# EAGLE design Moteino (EAGLE 6.3)
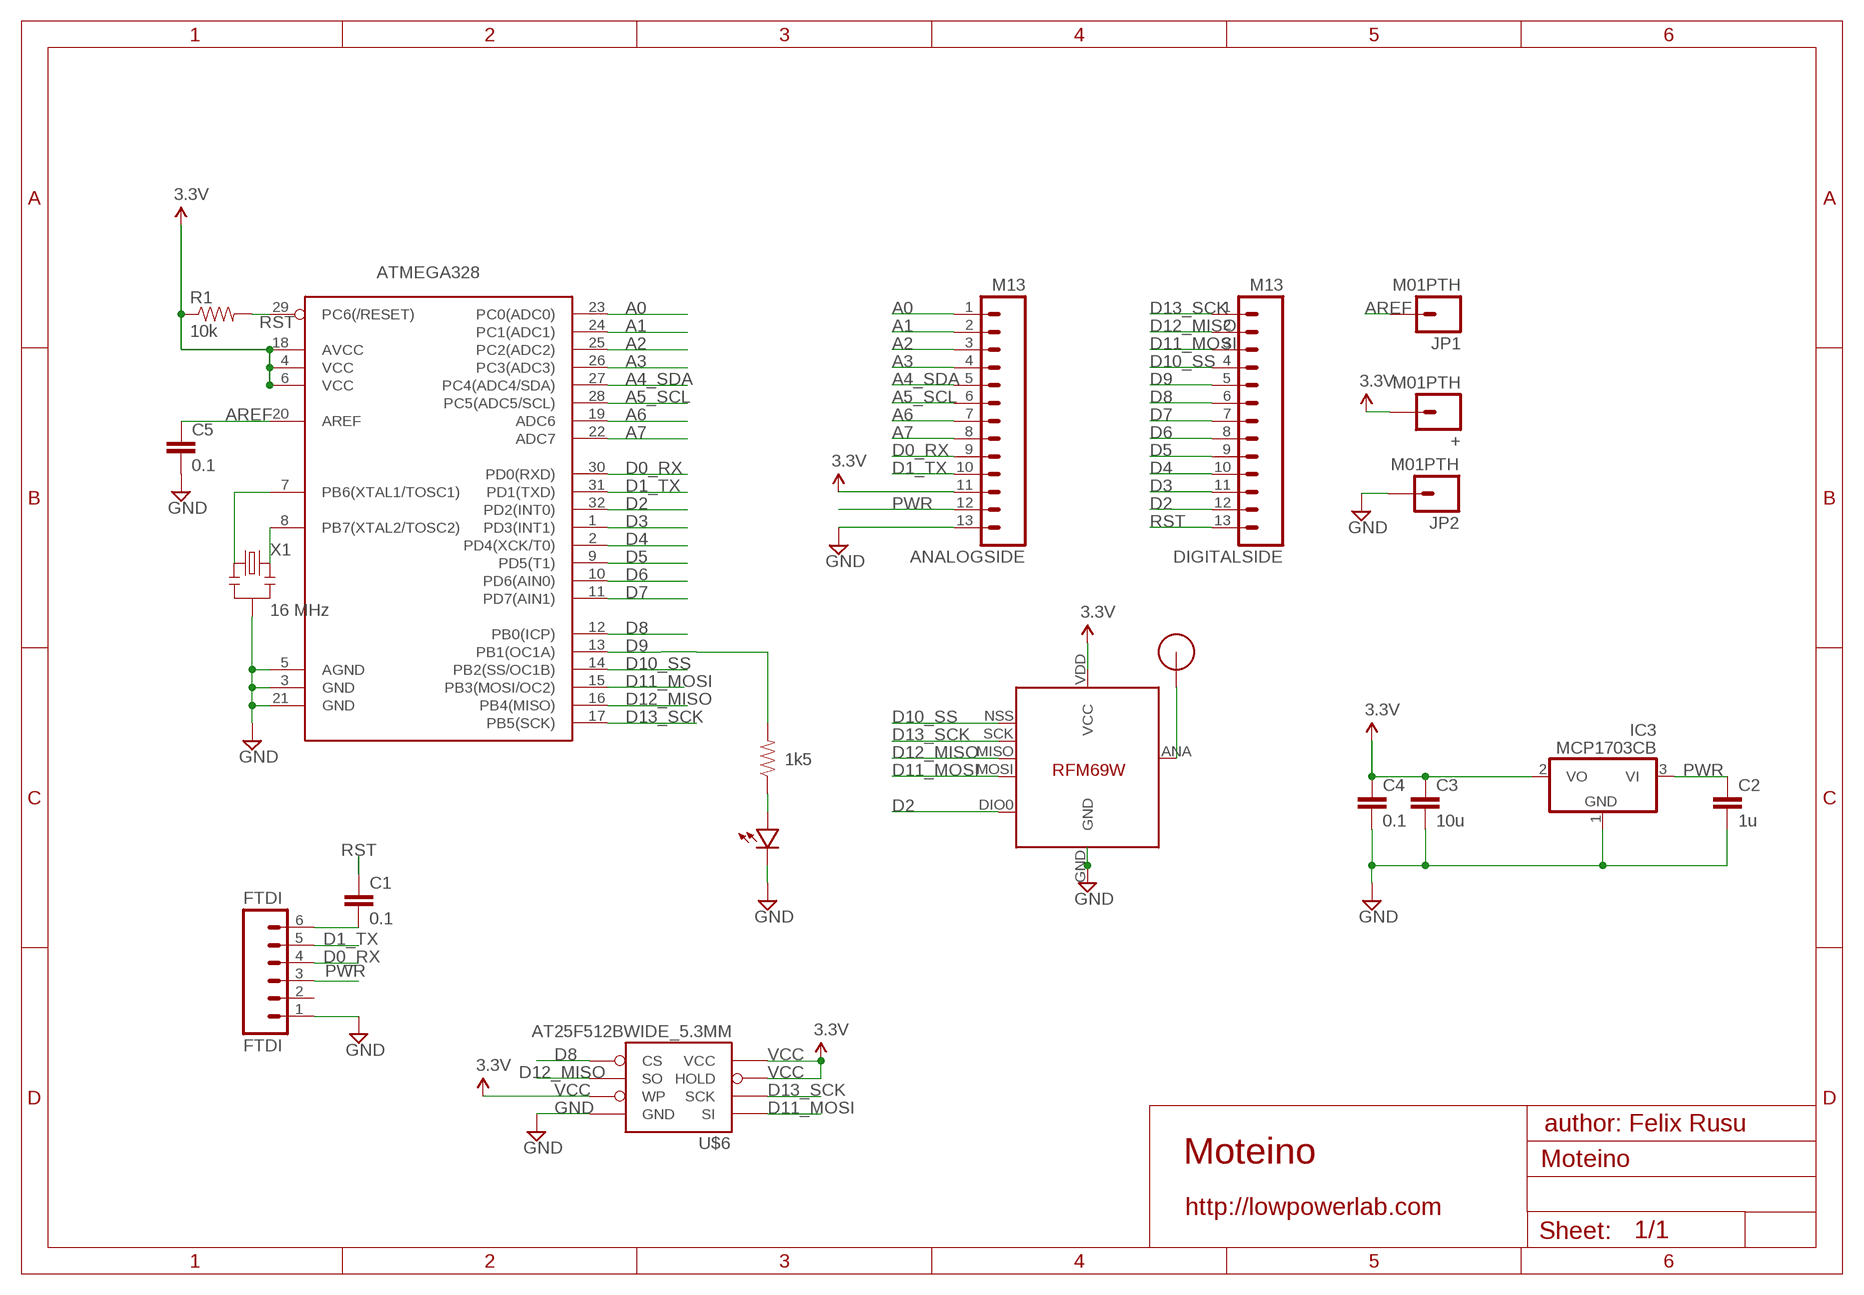
[diagram p0: schematic, sheet 1]

## Parts
+  M01PTH  [1X01]
ANALOGSIDE  M13  [1X13]
ATMEGA328  ATMega-328  ATMEGA168/328TQFP32  [TQFP32-08]
C1  0.1  CAP0603-CAP  [0603-CAP]
C2  1u  CAP0603-CAP  [0603-CAP]
C3  10u  CAP0805-CAP  [0805-CAP]
C4  0.1  CAP0603-CAP  [0603-CAP]
C5  0.1  CAP0603-CAP  [0603-CAP]
DIGITALSIDE  M13  [1X13]
FTDI  FTDI  M06SIP  [1X06]
IC3  MCP1703CB  [SOT23]
JP1  M01PTH  [1X01]
JP2  M01PTH  [1X01]
R1  10k  RESISTOR0603-RES  [0603-RES]
R2  1k5  RESISTOR0603-RES  [0603-RES]
U$1  RFM12B_ANTENNA  [RFM12B-ANTENNA]
U$2  LED0603  [0603-LED]
U$5  RFM69  [RFM69W-MINPADS]
U$6  AT25F512BWIDE_5.3MM  [SO08WIDE]
X1  16 MHz  RESONATORSMD  [RESONATOR-SMD]

## Nets
A0: ANALOGSIDE.1 ATMEGA328.23(PC0(ADC0))
A1: ANALOGSIDE.2 ATMEGA328.24(PC1(ADC1))
A2: ANALOGSIDE.3 ATMEGA328.25(PC2(ADC2))
A3: ANALOGSIDE.4 ATMEGA328.26(PC3(ADC3))
A4_SDA: ANALOGSIDE.5 ATMEGA328.27(PC4(ADC4/SDA))
A5_SCL: ANALOGSIDE.6 ATMEGA328.28(PC5(ADC5/SCL))
A6: ANALOGSIDE.7 ATMEGA328.19(ADC6)
A7: ANALOGSIDE.8 ATMEGA328.22(ADC7)
AREF: ATMEGA328.20(AREF) C5.1 JP1.1
D0_RX: ANALOGSIDE.9 ATMEGA328.30(PD0(RXD)) FTDI.4
D1_TX: ANALOGSIDE.10 ATMEGA328.31(PD1(TXD)) FTDI.5
D2: ATMEGA328.32(PD2(INT0)) DIGITALSIDE.12 U$5.DIO0
D3: ATMEGA328.1(PD3(INT1)) DIGITALSIDE.11
D4: ATMEGA328.2(PD4(XCK/T0)) DIGITALSIDE.10
D5: ATMEGA328.9(PD5(T1)) DIGITALSIDE.9
D6: ATMEGA328.10(PD6(AIN0)) DIGITALSIDE.8
D7: ATMEGA328.11(PD7(AIN1)) DIGITALSIDE.7
D8: ATMEGA328.12(PB0(ICP)) DIGITALSIDE.6 U$6.1(CS)
D9: ATMEGA328.13(PB1(OC1A)) DIGITALSIDE.5 R2.2
D10_SS: ATMEGA328.14(PB2(SS/OC1B)) DIGITALSIDE.4 U$5.NSS(SEL)
D11_MOSI: ATMEGA328.15(PB3(MOSI/OC2)) DIGITALSIDE.3 U$5.MOSI U$6.5(SI)
D12_MISO: ATMEGA328.16(PB4(MISO)) DIGITALSIDE.2 U$5.MISO U$6.2(SO)
D13_SCK: ATMEGA328.17(PB5(SCK)) DIGITALSIDE.1 U$5.SCK U$6.6(SCK)
GND [power]: ANALOGSIDE.13 ATMEGA328.3(GND) ATMEGA328.5(AGND) ATMEGA328.21(GND) C2.2 C3.2 C4.2 C5.2 FTDI.1 IC3.1(GND) JP2.1 U$2.MINUS U$5.GND U$6.4(GND) X1.2
N$1: ATMEGA328.7(PB6(XTAL1/TOSC1)) X1.1
N$2: R2.1 U$2.PLUS
N$3: U$1.P$1 U$5.ANA(ANT)
N$20: C1.2 FTDI.6
N$21: ATMEGA328.8(PB7(XTAL2/TOSC2)) X1.3
PWR [power]: ANALOGSIDE.12 C2.1 FTDI.3 IC3.3(VI)
RST: ATMEGA328.29(PC6(/RESET)) C1.1 DIGITALSIDE.13 R1.2
VCC: +.1 ANALOGSIDE.11 ATMEGA328.4(VCC) ATMEGA328.6(VCC) ATMEGA328.18(AVCC) C3.1 C4.1 IC3.2(VO) R1.1 U$5.VDD(VCC) U$6.3(WP) U$6.7(HOLD) U$6.8(VCC) ; supply symbol labelled 3.3V
Unconnected: FTDI.2

## Notes on the sheet
- author: Felix Rusu
- Moteino
- http://lowpowerlab.com

## Library data of the parts
+ JP1 JP2 = SparkFun-Connectors:M01: Header 1 Standard 1-pin 0.1" header. Use with straight break away headers (SKU : PRT-00116), right angle break away headers (PRT-00553), swiss pins (PRT-00743), machine pins (PRT-00117), and female headers (PRT-00115).
ANALOGSIDE DIGITALSIDE = SparkFun-Connectors:M13: 13-pin single row .1" header
ATMEGA328 = LowPowerLab:ATMEGA168/328: Atmel 32-pin 8-bit micro, 16k flash.
C1-C5 = LowPowerLab:CAP: Capacitor Standard 0603 ceramic capacitor, and 0.1" leaded capacitor.
FTDI = SparkFun-Connectors:M06: Header 6 Standard 6-pin 0.1" header. Use with straight break away headers (SKU : PRT-00116), right angle break away headers (PRT-00553), swiss pins (PRT-00743), machine pins (PRT-00117), and female headers (PRT-00115). Molex polarized connector foot print use with SKU : PRT-08094 with associated crimp pins and housings. NOTES ON THE VARIANTS LOCK and LOCK_LONGPADS... This footprint was designed to help hold the alignment of a through-hole component (i.e. 6-pin header) while soldering it into place. You may notice that each hole has been shifted either up or down by 0.005 of an inch from it's more standard position (which is a perfectly straight line). This slight alteration caused the pins (the squares in the middle) to touch the edges of the holes. Because they are alternating, it causes a "brace" to hold the component in place. 0.005 has proven to be the perfect amount of "off-center" position when using our standard breakaway headers. Although looks a little odd when you look at the bare footprint, once you have a header in there, the alteration is very hard to notice. Also, if you push a header all the way into place, it is covered up entirely on the bottom side. This idea of altering the position of holes to aid alignment will be further integrated into the Sparkfun Library for other footprints. It can help hold any component with 3 or more connection pins.
IC3 = linear:MCP1703: 250 mA, 16V, Low Quiescent Current LDO Regulator Source: http://ww1.microchip.com/downloads/en/DeviceDoc/22049b.pdf
R1 R2 = LowPowerLab:RESISTOR: Resistor Basic schematic elements and footprints for 0603, 1206, and PTH resistors.
U$1 = LowPowerLab:RFM12B_ANTENNA
U$2 = LowPowerLab:LED
U$5 = LowPowerLab:RFM69
U$6 = LowPowerLab:AT25F512B: 4-Mbit SPI flash memory
X1 = SparkFun:RESONATOR: Resonator Small SMD resonator. This is the itty bitty 10/20MHz resonators with built in caps. CSTCE10M0G55 and CSTCE20M0V53. Footprint has been reviewed closely but hasn't been tested yet.

## Net classes
1 power: width 0.381 mm, clearance 0.254 mm

## Board
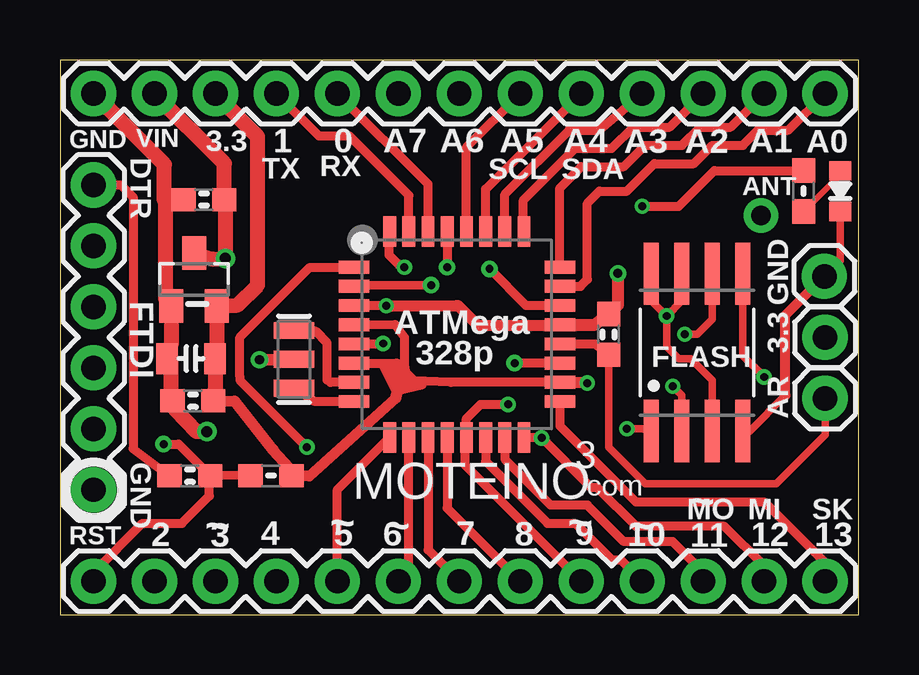
[diagram p1: board, top side]
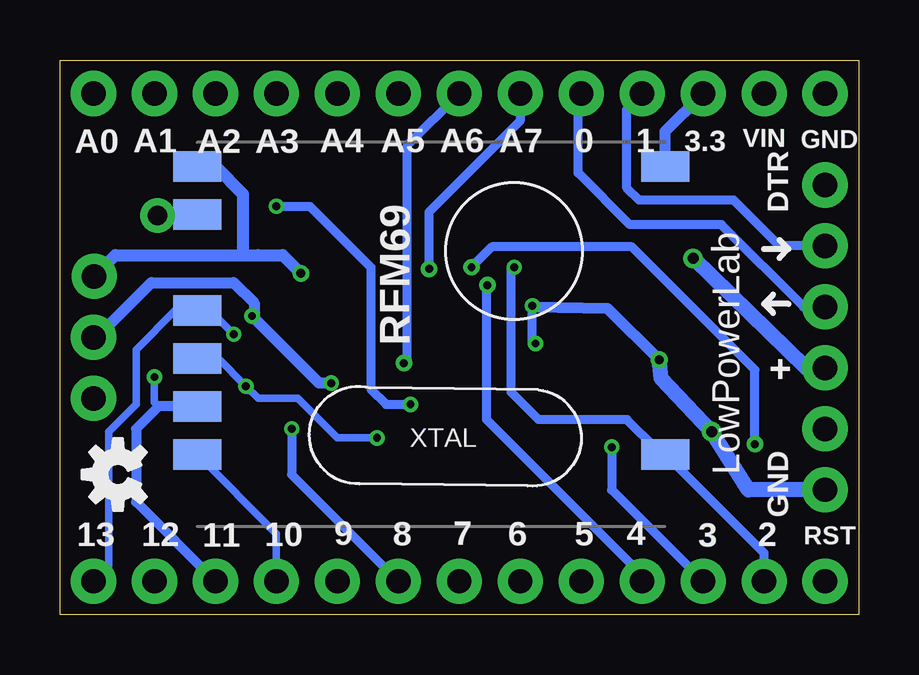
[diagram p2: board, bottom side, seen from below]

Size 33.27 x 23.11 mm. Coordinates in mm from the lower left corner, seen from the top.
Outline: 0,0 33.27,0 33.27,23.11 0,23.11 0,0
Copper layers (1*16): Top 0.035mm / dielectric 1.5mm / Bottom 0.035mm
Design rules "ITEADstudio_DRC": minimum track width 6mil, minimum drill 12mil, track to track 6mil, track to pad 6mil, pad to pad 6mil, via to via 6mil, smd to smd 0mil, copper to edge 10mil, drill to drill 10mil, minimum pad ring 10mil, minimum via ring 6mil, stop-mask expansion 2mil, vias tented up to drill 100mil, thermal gap 10mil

### Footprints (pad centres in the part's own frame; a part is rotated, then mirrored left to right if it is on the bottom)
1X01 = drill 1.016 pad 1.88: 1 0,0
1X13 = drill 1.016 pad 1.88: 1 0,0; 2 2.54,0; 3 5.08,0; 4 7.62,0; 5 10.16,0; 6 12.7,0; 7 15.24,0; 8 17.78,0; 9 20.32,0; 10 22.86,0; 11 25.4,0; 12 27.94,0; 13 30.48,0
TQFP32-08 = smd 1.27 x 0.533: 1 -4.293,2.8; 2 -4.293,2; 3 -4.293,1.2; 4 -4.293,0.4; 5 -4.293,-0.4; 6 -4.293,-1.2; 7 -4.293,-2; 8 -4.293,-2.8; 17 4.293,-2.8; 18 4.293,-2; 19 4.293,-1.2; 20 4.293,-0.4; 21 4.293,0.4; 22 4.293,1.2; 23 4.293,2; 24 4.293,2.8 | smd 0.533 x 1.27: 9 -2.8,-4.293; 10 -2,-4.293; 11 -1.2,-4.293; 12 -0.4,-4.293; 13 0.4,-4.293; 14 1.2,-4.293; 15 2,-4.293; 16 2.8,-4.293; 25 2.8,4.293; 26 2,4.293; 27 1.2,4.293; 28 0.4,4.293; 29 -0.4,4.293; 30 -1.2,4.293; 31 -2,4.293; 32 -2.8,4.293
0603-CAP = smd 1.016 x 0.965: 1 -0.85,0; 2 0.85,0
0805-CAP = smd 0.902 x 1.3: 1 -1,0; 2 1,0
1X06 = drill 1.016 pad 1.88: 1 0,0; 2 2.54,0; 3 5.08,0; 4 7.62,0; 5 10.16,0; 6 12.7,0
SOT23 = smd 1 x 1.4: 1 -0.95,-1.1; 2 0.95,-1.1; 3 0,1.1
0603-RES = smd 1.016 x 0.965: 1 -0.85,0; 2 0.85,0
RFM12B-ANTENNA = drill 0.8 pad 1.422: P$1 0,0
0603-LED = smd 0.8 x 0.9: MINUS -0.85,0; PLUS 0.85,0
RFM69W-MINPADS = smd 2 x 1.27: ANA 8,-5; DIO0 -11.5,5; GND 8,-7; MISO 8,1; MOSI 8,3; NSS 8,5; SCK 8,-1; VDD -11.5,-7
SO08WIDE = smd 0.61 x 2.6: 1 -1.905,-3.269; 2 -0.635,-3.269; 3 0.635,-3.269; 4 1.905,-3.269; 5 1.905,3.286; 6 0.635,3.286; 7 -0.635,3.286; 8 -1.905,3.286
RESONATOR-SMD = smd 0.7 x 1.7: 1 -1.2,0; 2 0,0; 3 1.2,0

### Placement (x,y rotation side)
+  31.88,11.56 270 top
ANALOGSIDE  31.88,21.72 180 top
ATMEGA328  16.54,11.68 0 top
C1  5.41,5.79 180 top
C2  5.99,17.3 180 top
C3  5.46,10.67 180 top
C4  5.54,8.92 180 top
C5  22.86,11.68 90 top
DIGITALSIDE  31.88,1.4 180 top
FTDI  1.4,5.21 90 top
IC3  5.59,13.97 0 top
JP1  31.88,9.02 0 top
JP2  31.85,14.1 0 top
R1  8.79,5.79 180 top
R2  30.99,17.65 90 top
U$1  29.21,16.64 0 top
U$2  32.51,17.65 90 top
U$3  [OSHW-LOGO-S]  30.86,5.84 90 bottom
U$5  19.56,11.68 180 bottom
U$6  26.54,10.92 0 top
X1  9.75,10.64 270 top

### Tracks (layer width: path | path; a pad name or v marks a point on that pad's centre or on a via)
A0
  Top 0.381: ATMEGA328.23 21.68,13.68 21.97,13.97 21.97,17.14 22.48,17.65 23.62,17.65 24.77,18.8 26.42,18.8 27.18,19.56 28.45,19.56 29.08,20.19 30.35,20.19 ANALOGSIDE.1
A1
  Top 0.381: ATMEGA328.24 20.83,17.78 21.72,18.67 23.5,18.67 24.38,19.56 25.91,19.56 26.67,20.32 27.94,20.32 ANALOGSIDE.2
A2
  Top 0.381: ATMEGA328.25 19.3,15.98 19.3,17.27 21.46,19.43 22.99,19.43 23.88,20.32 25.4,20.32 ANALOGSIDE.3
A3
  Top 0.381: ATMEGA328.26 18.54,17.52 21.21,20.19 22.48,20.19 ANALOGSIDE.4
A4_SDA
  Top 0.381: ATMEGA328.27 17.73,17.73 ANALOGSIDE.5
A5_SCL
  Top 0.381: ATMEGA328.28 16.93,19.48 ANALOGSIDE.6
A6  (via drill 0.33 pad 0.69)
  Top 0.381: ATMEGA328.19 v18.95,10.48
  Bottom 0.381: v18.95,10.48 18.8,10.41 18.8,19.56 ANALOGSIDE.7
A7  (via drill 0.33 pad 0.69)
  Top 0.381: ATMEGA328.22 19.42,12.88 v17.9,14.41
  Bottom 0.381: ANALOGSIDE.8 14.1,20.57 17.91,16.76 v17.91,14.42 v17.9,14.41
AREF
  Top 0.305: C5.1 22.86,6.99 24.38,5.46 29.84,5.46 31.88,7.49 JP1.1
  Top 0.381: ATMEGA328.20 22.28,11.28 C5.1
  Bottom 0.381: JP1.1 31.24,9.02
D0_RX
  Top 0.381: ATMEGA328.30 15.34,17.94 ANALOGSIDE.9
  Bottom 0.381: FTDI.4 2.29,12.83 5.71,16.26 9.53,16.26 11.68,18.41 11.68,21.59 ANALOGSIDE.9
D1_TX
  Top 0.381: ATMEGA328.31 14.54,17.47 12.06,19.94 10.79,19.94 ANALOGSIDE.10
  Bottom 0.381: FTDI.5 3.3,15.37 5.21,17.27 9.14,17.27 9.65,17.78 9.65,21.08 ANALOGSIDE.10
D2  (via drill 0.33)
  Top 0.381: v14.35,14.48 14.22,14.48 13.72,14.99 13.72,15.83 ATMEGA328.32
  Bottom 0.381: DIGITALSIDE.12 3.94,2.56 U$5.DIO0 | 7.85,6.89 8.41,6.89 9.65,8.13 13.34,8.13 14.48,9.27 14.48,14.35 v14.35,14.48
  Bottom 0.406: U$5.DIO0 7.85,6.89
D3  (via drill 0.33)
  Top 0.381: ATMEGA328.1 10.41,14.48 7.49,11.56 7.49,9.91 7.49,9.78 v10.29,6.99
  Bottom 0.381: v10.29,6.99 10.29,5.21 DIGITALSIDE.11
D4  (via drill 0.33 pad 0.69)
  Top 0.356: v15.46,13.73 12.17,13.73
  Top 0.381: 12.17,13.73 ATMEGA328.2
  Bottom 0.381: DIGITALSIDE.10 9.02,1.65 15.49,8.13 15.49,13.58 v15.46,13.73
D5
  Top 0.381: DIGITALSIDE.9 11.56,5.21 ATMEGA328.9
D6
  Top 0.381: DIGITALSIDE.8 14.54,1.83 ATMEGA328.10
D7
  Top 0.381: ATMEGA328.11 15.34,2.7 DIGITALSIDE.7
D8  (via drill 0.33)
  Top 0.305: v23.62,7.75 24.24,7.75 U$6.1
  Top 0.381: ATMEGA328.12 16.14,4.44 DIGITALSIDE.6
  Bottom 0.381: v23.62,7.75 23.62,5.84 DIGITALSIDE.6
D9  (via drill 0.33)
  Top 0.381: DIGITALSIDE.5 16.89,6.22 16.89,7.31 ATMEGA328.13 16.93,8.17 17.53,8.76 v18.67,8.76 | v24.26,17.02 25.78,17.02 27.27,18.5 R2.2
  Bottom 0.381: v24.26,17.02 22.86,17.02 20.32,14.48 20.32,9.4 19.68,8.76 19.56,8.76 v18.67,8.76
D10_SS
  Top 0.381: ATMEGA328.14 17.73,6.39 20.32,3.81 21.46,3.81 22.99,2.29 23.37,2.29 DIGITALSIDE.4
  Bottom 0.305: DIGITALSIDE.4 24.26,3.38 U$5.NSS
D11_MOSI  (via drill 0.33)
  Top 0.305: v29.34,9.91 28.45,10.79 U$6.5
  Top 0.381: ATMEGA328.15 18.54,6.48 20.45,4.57 21.97,4.57 23.5,3.05 25.53,3.05 26.8,1.78 DIGITALSIDE.3
  Bottom 0.305: v29.34,9.91 29.34,8.86 29.16,8.68
  Bottom 0.406: U$5.MOSI 29.16,8.68 30.1,7.75 30.1,4.7 DIGITALSIDE.3
D12_MISO  (via drill 0.33)
  Top 0.305: v25.53,9.53 25.91,9.14 25.91,8.51 U$6.2
  Top 0.381: ATMEGA328.16 19.91,7.39 v20.07,7.37 22.14,5.29 22.39,5.29 24,3.68 27.69,3.68 29.34,2.03 DIGITALSIDE.2
  Bottom 0.305: U$5.MISO 26.69,10.68 v25.53,9.53 | v25.53,9.53 25.84,9.84 | v20.07,7.37 21.72,7.37 23.37,9.02 25.02,9.02 v25.53,9.53
D13_SCK  (via drill 0.33)
  Top 0.305: v26.04,11.68 26.54,11.68 27.18,12.32 U$6.6
  Top 0.381: DIGITALSIDE.1 31.88,2.16 29.34,4.7 24,4.7 20.83,7.87 ATMEGA328.17
  Bottom 0.305: DIGITALSIDE.1 31.24,2.03 31.24,7.62 30.1,8.76 30.1,11.05 28.46,12.68 U$5.SCK 27.32,12.68 27.04,12.68 v26.04,11.68
GND  (via drill 0.33, 0.38, 0.38 pad 0.71, 0.46 pad 0.81)
  Top 0.305: U$2.MINUS 32.51,14.76 JP2.1 | 30.23,9.14 28.73,7.65 U$6.4
  Top 0.381: 4.64,12.04 IC3.1 | C4.2 4.82,9.07 | 20.94,12.06 ATMEGA328.21 | 9.02,10.64 X1.2 | ATMEGA328.5 13.57,11.28 v13.46,11.3 | v13.59,12.88 ATMEGA328.3 | 16.53,12.88 16.59,12.88
  Top 0.406: 30.23,9.14 30.23,12.47 JP2.1
  Top 0.457: 20.94,12.06 17.4,12.06 16.59,12.88 | v13.59,12.88 16.53,12.88
  Top 0.508: v8.31,10.62 9.02,10.64 | IC3.1 4.62,12.98 | 4.64,11.29 4.61,10.53 | 5.05,17.32 C2.2 | ATMEGA328.21 22.28,12.08 C5.2 23.24,12.91 v23.24,14.22
  Top 0.635: 4.64,12.04 4.64,11.29 | v6.12,7.62 5.69,7.62 4.82,8.53 4.82,9.07 | 4.35,17.26 4.42,17.17 5.03,17.27 4.39,17.17 4.39,13.18 IC3.1 | 4.35,17.26 5.05,17.32 | C4.2 4.61,9.12 4.61,10.53 4.6,10.66 C3.2 | 4.35,17.26 4.35,18.77 ANALOGSIDE.13
  Bottom 0.381: 13.59,12.81 v13.59,12.88 13.59,11.3 v13.46,11.3
  Bottom 0.457: v8.31,10.62 10.45,12.76 13.59,12.81 | 31.88,14.12 JP2.1
  Bottom 0.508: JP2.1 30.96,14.99 25.53,14.99 | 25.53,14.99 25.02,14.99 24,14.99 v23.24,14.22 | U$5.GND 26.81,18.68 25.65,17.53 25.65,15.11 25.53,14.99
  Bottom 0.635: v8.31,10.62 8.22,9.86 v6.12,7.62 4.59,5.21 FTDI.1
N$1
  Top 0.381: ATMEGA328.7 11.27,9.68 11.12,9.78 11.12,11.33 10.67,11.81 9.71,11.81 X1.1
N$2
  Top 0.254: R2.1 32.51,18.33 U$2.PLUS
N$3
  Bottom 0.381: U$5.ANA 28.5,16.68 U$1.P$1
N$20
  Top 0.381: FTDI.6 2.54,17.91 3.05,17.4 3.05,6.92 C1.2
N$21
  Top 0.381: ATMEGA328.8 10.62,8.88 X1.3
PWR  (via drill 0.46 pad 0.81)
  Top 0.635: IC3.3 6.35,14.82 v6.89,14.85 6.89,17.3 C2.1 6.84,18.81 6.78,18.87 ANALOGSIDE.12
  Bottom 0.635: FTDI.3 2.2,10.29 v6.89,14.85
RST  (via drill 0.33 pad 0.69)
  Top 0.254: 6.55,6.04 6.46,5.8
  Top 0.381: R1.2 6.46,5.8 | C1.1 6.55,6.04 | C1.1 6.01,5.5 | ATMEGA328.29 16.14,14.36 v16.13,14.48 | DIGITALSIDE.13 1.4,1.78 3.43,3.81 5.08,3.81 6.22,4.95 6.22,5.75 C1.1 | v4.32,7.11 4.94,7.11 C1.1
  Bottom 0.381: v16.13,14.48 15.28,15.33 9.45,15.33 4.36,10.24 4.32,10.2 v4.32,7.11
VCC  (via drill 0.33)
  Top 0.305: v25.27,12.45 24.64,13.08 U$6.8 | v25.27,12.45 25.91,13.08 U$6.7 | v25.27,12.45 25.27,11.18 25.78,10.67 26.29,10.67 27.18,9.78 U$6.3
  Top 0.356: ATMEGA328.4 13.95,12.08
  Top 0.381: C4.1 6.48,9.5 | 13.95,12.08 14.35,11.56 14.35,10.41 | 14.35,10.41 14.48,9.65 | ATMEGA328.6 14.03,10.48 14.35,10.41 | ATMEGA328.18 16.29,9.68 14.73,9.74 15.06,9.62
  Top 0.406: 14.48,9.65 13.46,10.41 13.97,9.4 14.1,10.41 14.73,9.74
  Top 0.432: 13.99,9.02 10.38,5.78
  Top 0.457: 10.38,5.78 R1.1 | 9.78,5.88 8.89,6.86 7.27,8.9 C4.1 | 13.99,9.02 14.09,9.4 15.06,9.62 | ATMEGA328.18 21.88,9.68 v21.97,9.65
  Top 0.508: 6.54,10.85 6.54,11.05
  Top 0.635: 6.54,11.05 IC3.2 7.39,12.89 8.23,13.73 8.23,19.93 ANALOGSIDE.11 | R1.1 9.78,5.88 | C4.1 6.46,9.37 C3.1 6.46,10.8 6.54,10.85
  Bottom 0.457: v21.97,9.65 22.48,9.65 v25.27,12.45 25.18,12.54 25.18,12.99 26.04,13.84 29.46,13.84 31.75,11.56 +.1 | U$5.VDD 8.06,20.14 ANALOGSIDE.11

### Text on the board
tPlace: 3 | MOTEINO | .com
bPlace: RFM69 | LowPowerLab
tDocu: REG
_tsilk: VIN | 3.3 | 1 | 0 | A7 | A6 | A5 | A4 | A3 | A2 | A1 | GND | DTR | TX | RX | A0 | SCL | SDA | ANT | GND | 3.3 | ATMega | FTDI | 328p | FLASH | AR | GND | 2 | 3 | 4 | 5 | 6 | 7 | 8 | 9 | 10 | MO | ~ | 11 | MI | 12 | SK | 13 | RST | ~ | ~ | ~ | ~ | ~
_bsilk: VIN | 3.3 | 1 | 0 | A7 | A6 | A5 | A4 | A3 | A2 | A1 | A0 | GND | DTR | + | GND | 2 | 3 | 4 | 5 | 6 | 7 | 8 | 9 | 10 | 11 | 12 | 13 | RST